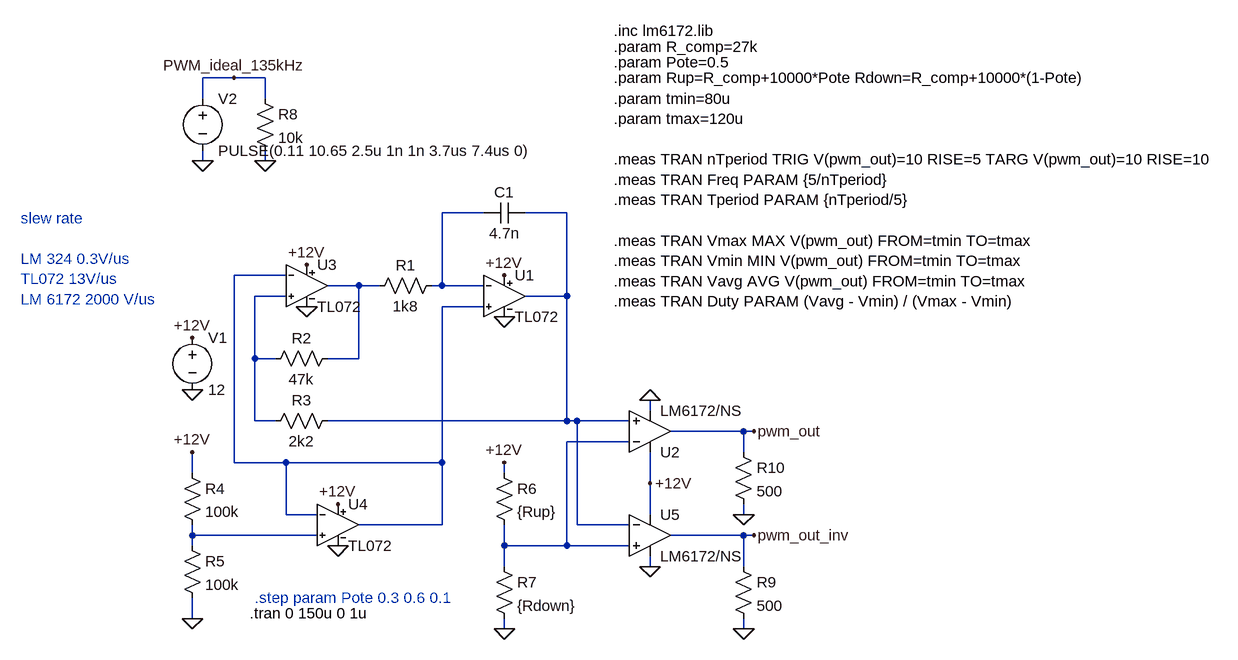
[diagram p0: schematic PWM.asc]
PWM.asc, the LTspice schematic file:
Version 4.1
SHEET 1 1592 1048
WIRE 0 -224 -48 -224
WIRE 48 -224 0 -224
WIRE -48 -192 -48 -224
WIRE 48 -192 48 -224
WIRE -48 -96 -48 -112
WIRE 48 -96 48 -112
WIRE 384 -16 320 -16
WIRE 512 -16 448 -16
WIRE 80 80 0 80
WIRE 192 96 144 96
WIRE 224 96 192 96
WIRE 320 96 320 -16
WIRE 320 96 304 96
WIRE 384 96 320 96
WIRE 80 112 32 112
WIRE 512 112 512 -16
WIRE 512 112 448 112
WIRE 384 128 320 128
WIRE 32 208 32 112
WIRE 64 208 32 208
WIRE 192 208 192 96
WIRE 192 208 144 208
WIRE 640 288 640 272
WIRE 32 304 32 208
WIRE 64 304 32 304
WIRE 512 304 512 112
WIRE 512 304 144 304
WIRE 528 304 512 304
WIRE 608 304 528 304
WIRE 784 320 672 320
WIRE 800 320 784 320
WIRE 608 336 512 336
WIRE 784 352 784 320
WIRE 0 368 0 80
WIRE 80 368 0 368
WIRE 320 368 320 128
WIRE 320 368 80 368
WIRE -64 384 -64 352
WIRE 416 384 416 368
WIRE 640 400 640 352
WIRE 80 448 80 368
WIRE 128 448 80 448
WIRE 640 448 640 400
WIRE 784 448 784 432
WIRE 320 464 320 368
WIRE 320 464 192 464
WIRE 528 464 528 304
WIRE 608 464 528 464
WIRE -64 480 -64 464
WIRE 128 480 -64 480
WIRE 784 480 672 480
WIRE 800 480 784 480
WIRE -64 496 -64 480
WIRE 416 496 416 464
WIRE 512 496 512 336
WIRE 512 496 416 496
WIRE 608 496 512 496
WIRE 416 528 416 496
WIRE 640 528 640 512
WIRE 784 528 784 480
WIRE -64 608 -64 576
WIRE 416 624 416 608
WIRE 784 624 784 608
FLAG -64 256 0
FLAG -64 176 +12V
FLAG -64 608 0
FLAG 160 496 0
FLAG 112 128 0
FLAG 416 144 0
FLAG 640 272 0
FLAG 112 64 +12V
FLAG 416 80 +12V
FLAG 160 432 +12V
FLAG -64 352 +12V
FLAG 416 624 0
FLAG 416 368 +12V
FLAG 800 320 pwm_out
FLAG -48 -96 0
FLAG 48 -96 0
FLAG 0 -224 PWM_ideal_135kHz
FLAG 640 528 0
FLAG 800 480 pwm_out_inv
FLAG 640 400 +12V
FLAG 784 448 0
FLAG 784 624 0
SYMBOL res 320 80 R90
WINDOW 0 0 56 VBottom 2
WINDOW 3 32 56 VTop 2
SYMATTR InstName R1
SYMATTR Value 1k8
SYMBOL cap 448 -32 R90
WINDOW 0 0 32 VBottom 2
WINDOW 3 32 32 VTop 2
SYMATTR InstName C1
SYMATTR Value 4.7n
SYMBOL res 160 192 R90
WINDOW 0 0 56 VBottom 2
WINDOW 3 32 56 VTop 2
SYMATTR InstName R2
SYMATTR Value 47k
SYMBOL res 160 288 R90
WINDOW 0 0 56 VBottom 2
WINDOW 3 32 56 VTop 2
SYMATTR InstName R3
SYMATTR Value 2k2
SYMBOL voltage -64 160 R0
WINDOW 123 0 0 Left 0
WINDOW 39 0 0 Left 0
SYMATTR InstName V1
SYMATTR Value 12
SYMBOL res -80 368 R0
SYMATTR InstName R4
SYMATTR Value 100k
SYMBOL res -80 480 R0
SYMATTR InstName R5
SYMATTR Value 100k
SYMBOL res 400 368 R0
SYMATTR InstName R6
SYMATTR Value {Rup}
SYMBOL res 400 512 R0
SYMATTR InstName R7
SYMATTR Value {Rdown}
SYMBOL TL072 416 48 R0
SYMATTR InstName U1
SYMBOL TL072 112 32 R0
SYMATTR InstName U3
SYMBOL TL072 160 400 R0
SYMATTR InstName U4
SYMBOL voltage -48 -208 R0
WINDOW 123 0 0 Left 0
WINDOW 39 0 0 Left 0
SYMATTR InstName V2
SYMATTR Value PULSE(0.11 10.65 2.5u 1n 1n 3.7us 7.4us 0)
SYMBOL res 32 -208 R0
SYMATTR InstName R8
SYMATTR Value 10k
SYMBOL OpAmps\\opamp2 640 384 M180
SYMATTR InstName U2
SYMATTR Value LM6172/NS
SYMBOL OpAmps\\opamp2 640 416 R0
SYMATTR InstName U5
SYMATTR Value LM6172/NS
SYMBOL res 768 512 R0
SYMATTR InstName R9
SYMATTR Value 500
SYMBOL res 768 336 R0
SYMATTR InstName R10
SYMATTR Value 500
TEXT 24 600 Left 2 !.tran 0 150u 0 1u
TEXT 584 -248 Left 2 !.param Pote=0.5
TEXT 584 -224 Left 2 !.param Rup=R_comp+10000*Pote Rdown=R_comp+10000*(1-Pote)
TEXT 584 -192 Left 2 !.param tmin=80u\n.param tmax=120u\n \n.meas TRAN nTperiod TRIG V(pwm_out)=10 RISE=5 TARG V(pwm_out)=10 RISE=10\n.meas TRAN Freq PARAM {5/nTperiod}\n.meas TRAN Tperiod PARAM {nTperiod/5}\n \n.meas TRAN Vmax MAX V(pwm_out) FROM=tmin TO=tmax\n.meas TRAN Vmin MIN V(pwm_out) FROM=tmin TO=tmax\n.meas TRAN Vavg AVG V(pwm_out) FROM=tmin TO=tmax\n.meas TRAN Duty PARAM (Vavg - Vmin) / (Vmax - Vmin)
TEXT 584 -296 Left 2 !.inc lm6172.lib
TEXT 32 576 Left 2 ;.step param Pote 0.3 0.6 0.1
TEXT 584 -272 Left 2 !.param R_comp=27k
TEXT -328 -8 Left 2 ;slew rate\n \nLM 324 0.3V/us\nTL072 13V/us\nLM 6172 2000 V/us

The netlist it stands for:
* PWM.asc
R1 N001 N004 1k8
C1 N002 N001 4.7n
R2 N004 N005 47k
R3 N002 N005 2k2
V1 +12V 0 12
R4 +12V N007 100k
R5 N007 0 100k
R6 +12V N006 {Rup}
R7 N006 0 {Rdown}
X§U1 N003 N001 +12V 0 N002 TL072  ; pins In+ In- V+ V- OUT
X§U3 N005 N003 +12V 0 N004 TL072  ; pins In+ In- V+ V- OUT
X§U4 N007 N003 +12V 0 N003 TL072  ; pins In+ In- V+ V- OUT
V2 PWM_ideal_135kHz 0 PULSE(0.11 10.65 2.5u 1n 1n 3.7us 7.4us 0)
R8 PWM_ideal_135kHz 0 10k
X§U2 N002 N006 +12V 0 pwm_out LM6172/NS  ; pins In+ In- V+ V- OUT
X§U5 N006 N002 +12V 0 pwm_out_inv LM6172/NS  ; pins In+ In- V+ V- OUT
R9 pwm_out_inv 0 500
R10 pwm_out 0 500
.tran 0 150u 0 1u
.param Pote=0.5
.param Rup=R_comp+10000*Pote Rdown=R_comp+10000*(1-Pote)
.param tmin=80u
.param tmax=120u
.meas TRAN nTperiod TRIG V(pwm_out)=10 RISE=5 TARG V(pwm_out)=10 RISE=10
.meas TRAN Freq PARAM {5/nTperiod}
.meas TRAN Tperiod PARAM {nTperiod/5}
.meas TRAN Vmax MAX V(pwm_out) FROM=tmin TO=tmax
.meas TRAN Vmin MIN V(pwm_out) FROM=tmin TO=tmax
.meas TRAN Vavg AVG V(pwm_out) FROM=tmin TO=tmax
.meas TRAN Duty PARAM (Vavg - Vmin) / (Vmax - Vmin)
.inc lm6172.lib
* .step param Pote 0.3 0.6 0.1
.param R_comp=27k
* slew rate
* LM 324 0.3V/us
* TL072 13V/us
* LM 6172 2000 V/us
.lib TL072.sub
.backanno
.end